# Altium schematic sheet ActiveFilters.SchDoc
size A4; SheetNumber: 1; SheetTotal: 1
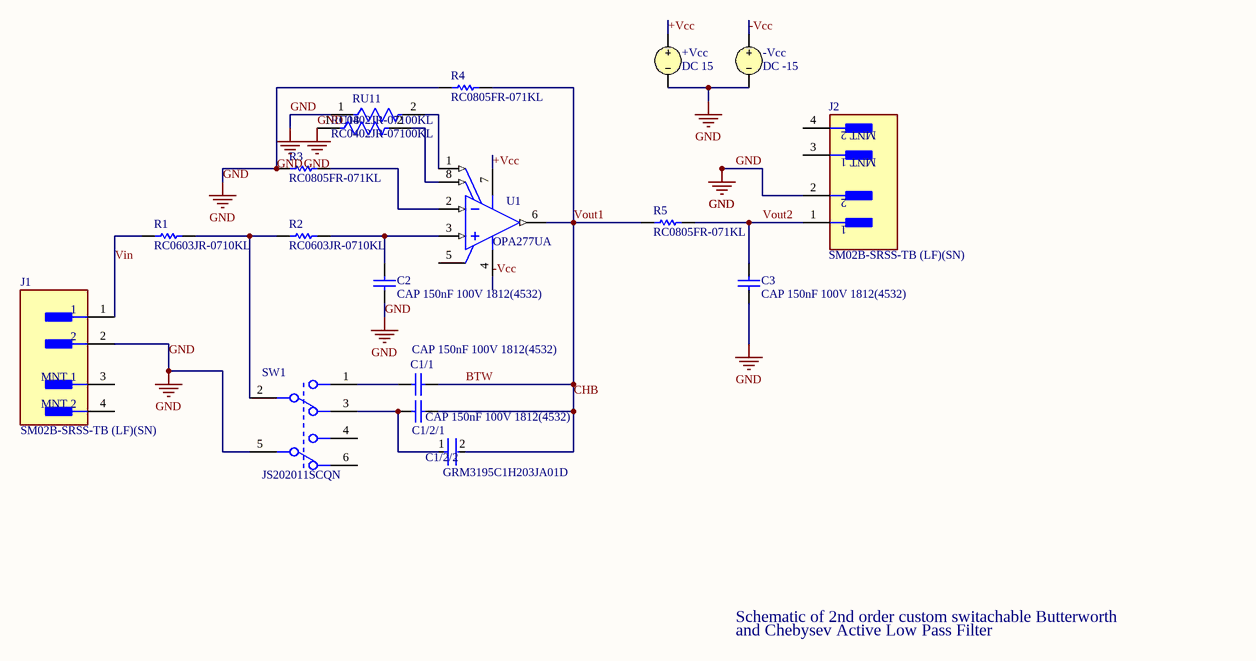
[diagram p0: ActiveFilters.SchDoc]

## Parts
+Vcc  DC 15
-Vcc  DC -15
C1/1  CAP 150nF 100V 1812(4532)  [CAPC1812(4532)230_N]
C1/2/1  CAP 150nF 100V 1812(4532)  [CAPC1812(4532)230_N]
C1/2/2  GRM3195C1H203JA01D  [FP-GRM319-0_15-IPC_C]
C2  CAP 150nF 100V 1812(4532)  [CAPC1812(4532)230_N]
C3  CAP 150nF 100V 1812(4532)  [CAPC1812(4532)230_N]
J1  SM02B-SRSS-TB (LF)(SN)  [FP-SM02B-SRSS-TB_LF_SN-MFG]
J2  SM02B-SRSS-TB (LF)(SN)  [FP-SM02B-SRSS-TB_LF_SN-MFG]
R1  RC0603JR-0710KL  [RESC1608X55X25ML10T15]
R2  RC0603JR-0710KL  [RESC1608X55X25ML10T15]
R3  RC0805FR-071KL  [RESC2013X60X35ML10T20]
R4  RC0805FR-071KL  [RESC2013X60X35ML10T20]
R5  RC0805FR-071KL  [RESC2013X60X35ML10T20]
RU11  RC0402JR-07100KL  [FP-RC0402-0_4-IPC_A]
RU18  RC0402JR-07100KL  [FP-RC0402-0_4-IPC_A]
SW1  JS202011SCQN  [FP-JS202011SCQN-MFG]
U1  OPA277UA  [D0008A_N]

## Nets
GND: +Vcc.2 -Vcc.2 C2.1 C3.1 J1.2 J2.2 R3.1 R4.1 RU11.1 RU18.1 SW1.5
+Vcc: +Vcc.1 U1.7(V+)
-Vcc: -Vcc.1 U1.4(V-)
BTW: C1/1.1 C1/2/1.1 C1/2/2.2 R4.2 R5.1 U1.6(OUT)  [also labelled CHB, Vout1]
Vin: J1.1 R1.1
Vout2: C3.2 J2.1 R5.2
NetC1/1_2: C1/1.2 SW1.1
NetC1/2/1_2: C1/2/1.2 C1/2/2.1 SW1.3
NetC2_2: C2.2 R2.2 U1.3(IN+)
NetR1_2: R1.2 R2.1 SW1.2
NetR3_2: R3.2 U1.2(IN-)
NetRU11_2: RU11.2 U1.1(OFFSET_TRIM)
NetRU18_2: RU18.2 U1.8(OFFSET_TRIM)

Not connected (* = marked no-connect by the designer): J1 3(MNT_1) 4(MNT_2); J2 3(MNT_1) 4(MNT_2); SW1 4 6; U1 5(NC)

## Notes on the sheet
- Schematic of 2nd order custom switachable Butterworth
- and Chebysev Active Low Pass Filter

## Library data of the parts
+Vcc = VSRC: Voltage Source; Note: PCB Footprint - Not required; AC Magnitude: 1; AC Phase: 0; Value: 15; Published: 8-Jun-2000; LatestRevisionDate: 17-Jul-2002; LatestRevisionNote: Re-released for DXP Platform.; PackageReference: Not Applicable; Publisher: Altium Limited
-Vcc = VSRC: Voltage Source; Note: PCB Footprint - Not required; AC Magnitude: 1; AC Phase: 0; Published: 8-Jun-2000; LatestRevisionDate: 17-Jul-2002; LatestRevisionNote: Re-released for DXP Platform.; PackageReference: Not Applicable; Publisher: Altium Limited; Value: -15
C1/1 C1/2/1 C2 C3 = CMP-1040-01383-1: CAP 150nF 100V ±5% 1812 (4532 Metric) Thickness 2.3mm SMD; Tolerance: Â±5%; Case-EIA: 1812; Case-Metric: 4532; Technology: SMT; Max Thickness: 2.3 mm; Value: 150nF; Rated Voltage: 100 V
C1/2/2 = CMP-06035-011753-1: Chip Multilayer Ceramic Capacitors for General Purpose, 1206, 20000pF, C0G, 30ppm/°C, 5%, 50V; Capacitance: 20nF; Temperature Coefficient: 30ppm/°C; Radiation Hardening: No; Max Operating Temperature: 125°C; Packaging: Tape and Reel; Voltage: 50V; Case Code (Imperial): 1206; Tolerance: 5%; Length: 3.2mm; Termination: SMD/SMT; Voltage Rating (DC): 50V; Dielectric: C0G; Case/Package: 1206; Height: 0.85mm; Min Operating Temperature: -55°C; Lead Free: Lead Free; Mount: Surface Mount; Width: 0.063inch; Package Quantity: 1; Voltage Rating: 50V; Case Code (Metric): 3216; Depth: 1.6mm; Thickness: 0.037inch
J1 J2 = CMP-17439-000368-1: CONN HEADER SMD R/A 2POS 1MM; Max Current Rating: 1A; Voltage Rating (AC): 50V; Current Rating: 700mA; Contact Resistance: 40mR; Number of Positions: 2; Insulation Resistance: 100MR; Fastening Type: Pull; Orientation: Right Angle; Insulation Color: Natural; Insulation Material: Nylon; Connector Type: Header; Contact Type: Male Pin; Number of Rows: 1; Housing Material: Polyamide; Contact Material: Copper Alloy; Mount: Surface Mount; Packaging: Tape and Reel; Lead Pitch: 1mm; REACH SVHC: No SVHC; Flammability Rating: UL94 V-0; Termination: Solder; Series: SR; Length: 4mm; Color: Natural; Min Operating Temperature: -25°C; Pitch: 1mm; Depth: 4.95mm; Contact Plating: Tin; Lead Free: Lead Free; Max Operating Temperature: 85°C; Contact Finish - Mating: TIN; Material: Polyamide; Voltage Rating: 50V; Max Voltage Rating (AC): 50V; Housing Color: Beige; Contact Shape: Square; Number of Contacts: 2
R1 R2 = CMP-2000-05022-1: Resistor, 10 KOhm, +/- 5%, 100 mW, -55 to 155 degC, 0603 (1608 Metric), RoHS, Tape and Reel; Manufacturer: Yageo; Resistance: 10kOhms; Voltage Rating: 50V; Temperature Coefficient: 100PPM/C; Power Rating: 100mW; Package Reference: 603; Series: RC; Case Code - mm: 1608; Packaging: Reel; Datasheet URL: http://www.farnell.com/datasheets/443971.pdf; Datasheet Version: Rev. 4, 04/2009; Operating Temperature Range: -55Cto+155C; Product: ThickFilmResistorsGeneralPurpose; Package Description: 2-Pin Surface Mount Device, Body 1.6 x 0.8 mm; Manufacturer URL: http://www.yageo.com/; Case Code - in: 0603; Tolerance: 5%; Termination Style: SMD/SMT
R3-R5 = CMP-2100-03671-1: Chip Resistor, 1 KOhm, +/- 1%, 125 mW, -55 to 155 degC, 0805 (2012 Metric), RoHS, Tape and Reel; Manufacturer: Yageo; Temperature Coefficient: 100ppm/degreesC; Voltage Rating (DC): 150V; Max Power Dissipation: 125mW; Resistance: 1KOhm; Number of Pins: 2; Number of Terminations: 2; Datasheet URL: http://www.yageo.com/NewPortal/yageodocoutput?fileName=/pdf/R-Chip/PYu-RC_Group_51_RoHS_L_5.pdf; Length: 0.079inch; Package Description: 2-Pin Surface Mounted Device, Body 2 x 1.25 mm; Depth: 1.25mm; Height: 0.024inch; Military Standard: Not; Case/Package: 0805; Package Reference: 0805; RoHSCompliant: true; Lead Free: LeadFree; Packaging: TapeandReel; Package Quantity: 1; Datasheet Version: Rev. 5, 10/2016; Tolerance: 1%; Min Operating Temperature: -55degC; Voltage Rating: 150V; Composition: ThickFilm; Case Code (Imperial): 0805; Power Rating: 125mW; Width: 0.049inch; Case Code (Metric): 2012; Manufacturer URL: http://www.yageo.com/; Max Operating Temperature: 155degC; REACH SVHC: Unknown; Termination: SMD/SMT
RU11 RU18 = CMP-2002-07913-2: RES 100K OHM 5% 1/16W 0402; Temperature Coefficient: 100ppm/°C; Max Power Dissipation: 63mW; Resistance: 100kR; Voltage Rating: 50V; Tolerance: 5%; Packaging: Tape and Reel; Termination: SMD/SMT; Case Code (Metric): 1005; Length: 1mm; Power Rating: 63mW; Min Operating Temperature: -55°C; Case/Package: 0402; Construction: Rectangular; Series: RC; Resistance Tolerance: 5%; Height: 0.016inch; Case Code (Imperial): 0402; RoHS Compliant: Yes; Size Code: 0402; Number of Terminations: 2; Features: Moisture Resistant; Width: 0.02inch; Max Operating Temperature: 155°C; Military Standard: Not; Lead Free: Lead Free; Depth: 0.5mm; Package Quantity: 1; Resistor Type: Thick Film
SW1 = CMP-2000-05087-3: SWITCH SLIDE DPDT 300MA 6V; Switch Function: On-On; Actuator Type: Standard; Switch Travel: 2mm; Actuator Color: Black; Contact Resistance: 70mR; Electrical Life: 5000Cycles; Actuator Material: Nylon; REACH SVHC: No SVHC; Series: JS; Min Operating Temperature: -20°C; Depth: 7.5mm; Housing Material: Nylon; Voltage Rating (DC): 6V; Max Operating Temperature: 85°C; Contact Current Rating: 300mA; Package Quantity: 1; Contact Plating: Silver; Contact Material: Copper Alloy; Throw Configuration: DPDT; Current Rating: 300mA; Orientation: Vertical; Max Current Rating: 300mA; Max Voltage Rating (DC): 6V; Flammability Rating: UL94 V-2; Length: 9mm; Packaging: Tape and Reel; Mount: Surface Mount; Actuator Length: 2mm; Lead Free: Lead Free; Termination: Gull Wing; Radiation Hardening: No
U1 = CMP-0272-00373-3: High Precision Operational Amplifier, 4 to 36 V, -40 to 85 degC, 8-pin SOIC (D8), Green (RoHS & no Sb/Br); Manufacturer: Texas Instruments; CMRR(Min)(dB): 115; IIB(Max)(pA): 2800; Number of Channels: 1; Packing: TUBE; Offset Drift(Typ)(uV/C): 0.15; Vio (25C)(Max)(mV): 0.05; Iq per channel(Max)(mA): 0.825; Sub Family: High Supply Voltage Amplifier (>=30V), Low Noise Amp (<=10nV/rtHz), Low Offset Voltage Amplifier (<=500uV), Precision Amplifier; Total Supply Voltage(Max)(+5V is 5, +/-5V is 10): 36; Slew Rate(Typ)(V/us): 0.8; Rating: Catalog; Total Supply Voltage(Min)(+5V is 5, +/-5V is 10): 4; PartNumber: OPA277UA; ComponentLink3URL: http://www.ti.com/litv/pdf/msoi002j; Mounting Technology: Surface Mount; DatasheetVersion: SBOS079A; ComponentLink1URL: http://www.ti.com/; PackageVersion: 4040047-3/M, 06/2011; PackageDescription: 8-Pin Plastic Small Outline, Body 4.9 x 3.9 mm, Pitch 1.27 mm; ComponentLink3Description: Package Specification; GBW(Typ)(MHz): 1; ComponentLink2URL: http://www.ti.com/lit/ds/symlink/opa277.pdf; Eco-Plan: Green (RoHS & no Sb/Br); PackageReference: D0008A; ComponentLink2Description: Datasheet; Code_JEDEC: MS-012; ComponentLink1Description: Manufacturer URL